# Altium project Perfect_Pour_HAT.PrjPcb
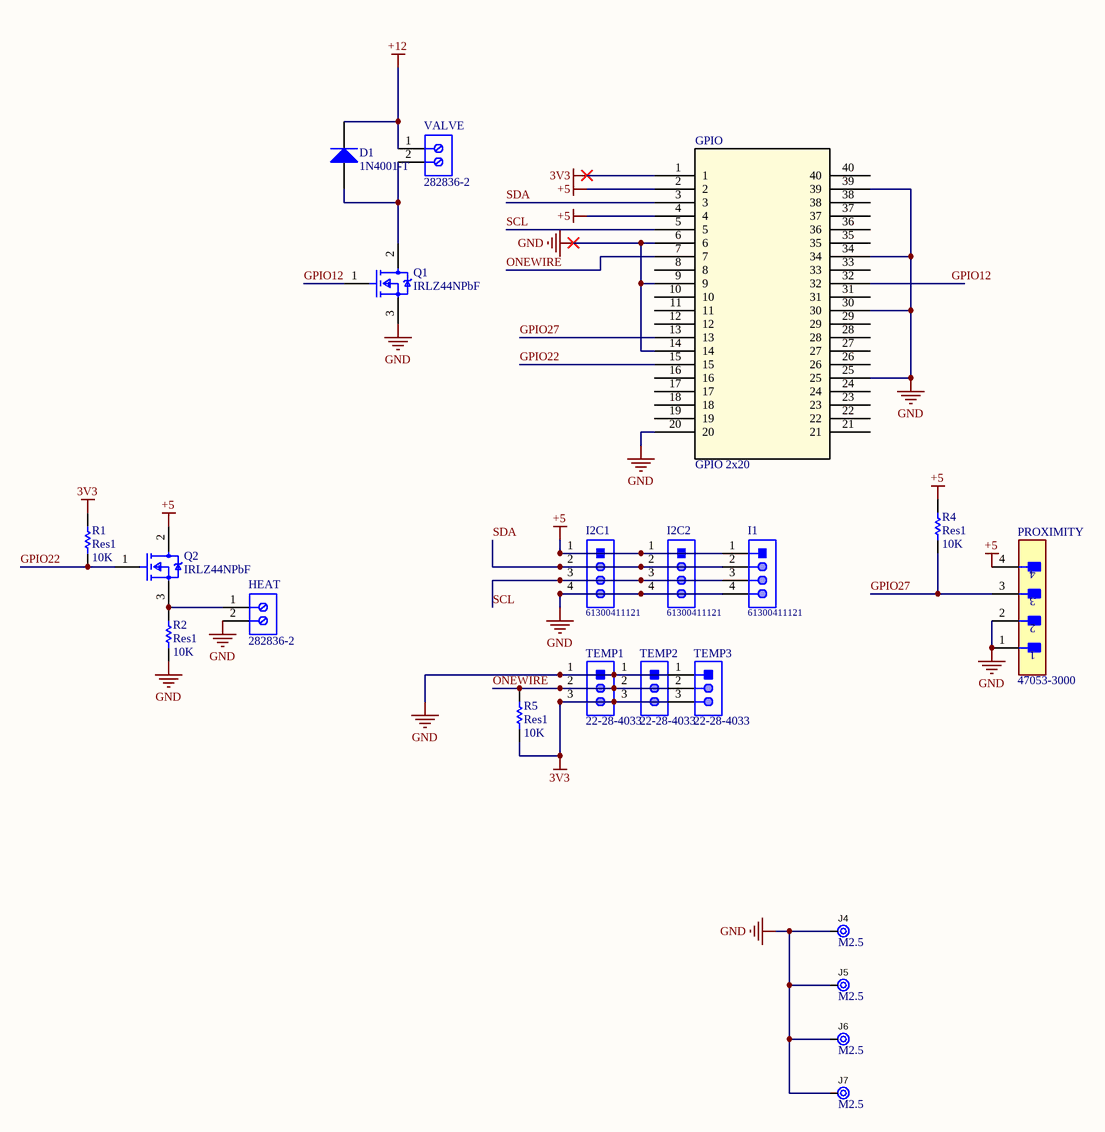
[diagram p0: ppschem.SchDoc]
1 sheet, 21 parts. Net scope: global (net labels, ports and power ports of the same name join across sheets).
Board file: pphat.PcbDoc

## Sheet ppschem.SchDoc: =DocumentName
size A3; Organization: CLIENT NAME HERE; Revision: 01; SheetNumber: 1; SheetTotal: 1; SPICEModelCacheSXWZTIYJ: <root> / <DocumentId>SXWZTIYJ</DocumentId> / </root>

### Parts
D1  1N4001-T  [DIOD-DO-41-P-2_V]
GPIO  GPIO 2x20  [GPIO2x20]
HEAT  282836-2  [TECO-282836-2_V]
I1  61300411121  [61300411121]
I2C1  61300411121  [61300411121]
I2C2  61300411121  [61300411121]
J4  M2.5  [M2.5 Drill Hole]
J5  M2.5  [M2.5 Drill Hole]
J6  M2.5  [M2.5 Drill Hole]
J7  M2.5  [M2.5 Drill Hole]
PROXIMITY  47053-3000  [FP-47053-3000-MFG]
Q1  IRLZ44NPbF  [FP-PG-TO220-3-MFG]
Q2  IRLZ44NPbF  [FP-PG-TO220-3-MFG]
R1  Res1  value 10K  [AXIAL-0.3]
R2  Res1  value 10K  [AXIAL-0.3]
R4  Res1  value 10K  [AXIAL-0.3]
R5  Res1  value 10K  [AXIAL-0.3]
TEMP1  22-28-4033  [MOLX-22-28-4033_V]
TEMP2  22-28-4033  [MOLX-22-28-4033_V]
TEMP3  22-28-4033  [MOLX-22-28-4033_V]
VALVE  282836-2  [TECO-282836-2_V]

### Nets
3V3: GPIO.1 R1.1 R5.1 TEMP1.3 TEMP2.3 TEMP3.3
+5: GPIO.2 GPIO.4 I1.1 I2C1.1 I2C2.1 PROXIMITY.4 Q2.2(D) R4.1
+12: D1.2(K) VALVE.1
GND: GPIO.6 GPIO.9 GPIO.14 GPIO.20 GPIO.25 GPIO.30 GPIO.34 GPIO.39 HEAT.2 I1.4 I2C1.4 I2C2.4 J4.?1 J5.?1 J6.?1 J7.?1 PROXIMITY.1 PROXIMITY.2 Q1.3(S) R2.2 TEMP1.1 TEMP2.1 TEMP3.1
GPIO12: GPIO.32 Q1.1(G)
GPIO22: GPIO.15 Q2.1(G) R1.2
GPIO27: GPIO.13 PROXIMITY.3 R4.2
ONEWIRE: GPIO.7 R5.2 TEMP1.2 TEMP2.2 TEMP3.2
SCL: GPIO.5 I1.3 I2C1.3 I2C2.3
SDA: GPIO.3 I1.2 I2C1.2 I2C2.2
NetD1_1: D1.1(A) Q1.2(D) VALVE.2
NetHEAT_1: HEAT.1 Q2.3(S) R2.1

Not connected (* = marked no-connect by the designer): GPIO 8 10 11 12 16 17 18 19 21 22 23 24 26 27 28 29 31 33 35 36 37 38 40

### Notes on the sheet
- Title
- Project
- ECEN 403 Team 19
- Size:
- Date:
- A3
- Sheet
- REV:
- of
- File:

### Library data of the parts
D1 = CMP-0639-00006-2: 1.0 A Rectifier, 15 pF, 50 V, -65 to 150 degC, 2-Pin DO-41 Plastic, RoHS, Tape and Reel; Manufacturer: Diodes Inc; VF (V): 1; CT (pF): 15; Max. IR (uA): 5; VRRM (V): 50; Max. IFSM (A): 30; RoHS: TRUE; Mounting Technology: Through Hole; PartNumber: 1N4001-T; ComponentLink2Description: Datasheet; DatasheetVersion: Rev. 8-2; Operating Temperature Range (degC): -65 to 150; Packing: Tape and Reel; PackageReference: DO-41-P-2; ComponentLink1URL: http://diodes.com/; PackageDescription: 2-Pin Axial Lead, Body 4.635 x 2.36 mm, Lead Spread 25.4 mm; ComponentLink2URL: http://diodes.com/datasheets/ds28002.pdf; Max. Average Rectified Current IO (A): 1; ComponentLink1Description: Manufacturer URL
GPIO = CON_383: Conn, GPIO 2x20; Mfr_Name: Adafruit Industries; Manufacturer_Part_Number: 2223; Connections: 40; Copyright: Copyright (C) 2022 Ultra Librarian. All rights reserved.; RefDes: RefDes; Type: DEV; DFC_index: CON_383; Mounting: TH; CreationDate: 11/3/2021; Creator: W.Liao; LeadFree: True; RoHS: True
HEAT VALVE = CMP-1684-00017-1: Female Header, Pitch 5 mm, 1 x 2 Position, Height 10 mm, Tail Length 3.5 mm, Rohs, Bulk; Manufacturer: TE Connectivity; Wire Gauge: 16-30AWG; Product Training Modules: Wire-to-BoardEurostyleTerminalBlocks; Clamp Material - Plating: Brass-NickelPlated; Voltage: 300V; Mating Orientation: HorizontalwithBoard; Current: 13.5A; Pitch: 0.197"(5.00mm); Screw Thread: M3; 3D Model: 282836-2.pdf; Other Names: 5ULV-02B / A98076; Dynamic Catalog: BuchananSeries; Number of Levels: 1; Torque - Screw: 0.68Nm(6Lb-In); Featured Product: EurostyleTerminalBlockConnectors; Positions Per Level: 2; Wire Termination: Screw-RisingCageClamp; Datasheet URL: http://www.te.com.cn/commerce/DocumentDelivery/DDEController?Action=showdoc&DocId=Catalog+Section%7F1308389_EUROSTYLE_TERMINAL_BLOCKS%7F0607%7Fpdf%7FEnglish%7FENG_CS_1308389_EUROSTYLE_TERMINAL_BLOCKS_0607.pdf%7F282836-2; Color: Green; Family: TerminalBlocks-WiretoBoard; RoHS Information: 282836-2StatementofCompliance; Standard Package: 300; Contact Material - Plating: Brass-TinPlated; Manufacturer URL: http://www.te.com; Housing Material: Polyamide(PA66),Nylon6/6; Features: Interlocking(Side); Package Description: Female Header, Pitch 5 mm, 1 x 2 Position, Height 10 mm, Tail Length 3.5 mm; Mounting Type: ThroughHole; Package Reference: THD; Packaging: Bulk; Series: Buchanan; Category: Connectors,Interconnects; Screw Material - Plating: Brass-NickelPlated
I1 I2C1 I2C2 = CMP-1502-01064-1: THT Vertical Pin Header WR-PHD, Pitch 2.54 mm, Single Row, 4 pins; Manufacturer: Wurth Elektronik; Withstanding Voltage: 500VAC; Rated Current: 3A; Working Voltage: 250VAC; Pin Number: 4; Gender: Male; Contact Resistance: 20mOhm; Pitch: 2.54mm; Manufacturer URL: http://www.we-online.de; Operating Temperature: -40to105degC; Packaging: Bag; Mounting Technology: THT; Package Reference: 61300411121; Datasheet URL: https://katalog.we-online.de/em/datasheet/6130xx11121.pdf; Publisher: WurthElektronik; Part Number: 61300411121; Row Number: Single; Orientation: Vertical
J4 = Mounting Hole: Raspberry Pi Mounting Hole, M2.5; DFC_index: CON_386; Mounting: TH; CreationDate: 1/20/2022; Creator: W.Liao; LeadFree: True; RoHS: True
J5-J7 = CON_386: Raspberry Pi Mounting Hole, M2.5; DFC_index: CON_386; Mounting: TH; CreationDate: 1/20/2022; Creator: W.Liao; LeadFree: True; RoHS: True
PROXIMITY = CMP-04776-000447-1: CONN HEADER VERT 4POS 2.54MM; Glow Wire Compliant: Non-compliant; Voltage Rating: 250V; Current Rating: 4A; Number of Circuits: 4; Gender: Male; Orientation: Straight; Packaging: Bulk; Series: 47053; RoHS Compliant: Yes; Termination: Through Hole; Contact Plating: Tin; Mount: Through Hole; Number of Rows: 1; Pitch: 2.54mm; Halogen Free: Low Halogen; Number of Contacts: 4; Min Operating Temperature: 0°C; Package Quantity: 12000; Contact Material: Copper Alloy; Max Operating Temperature: 75°C; REACH SVHC: No SVHC; Number of Positions: 4
Q1 Q2 = CMP-32901-000488-1: MOSFET N-CH 55V 47A TO220AB; Turn-On Delay Time: 11ns; Gate to Source Voltage (Vgs): 16V; Element Configuration: Single; Rds On Max: 22mR; Turn-Off Delay Time: 26ns; Max Power Dissipation: 110W; Threshold Voltage: 2V; Drain to Source Resistance: 35mR; Input Capacitance: 1.7nF; Continuous Drain Current (ID): 47A; Case/Package: TO-220; Lead Free: Lead Free; Halogen Free: Halogen Free; Packaging: Rail/Tube; Length: 0.414inch; Min Operating Temperature: -55°C; REACH SVHC: No SVHC; Number of Pins: 3; Width: 0.185inch; Drain to Source Voltage (Vdss): 55V; Power Dissipation: 110W; RoHS Compliant: Yes; Max Operating Temperature: 175°C; Height: 0.6inch; Max Dual Supply Voltage: 55V; Drain to Source Breakdown Voltage: 55V; Mount: Through Hole
R1 R2 R4 R5 = Res1: Resistor; Published: 8-Jun-2000; LatestRevisionDate: 17-Jul-2002; LatestRevisionNote: Re-released for DXP Platform.; PackageReference: AXIAL-0.3; Publisher: Altium Limited; PackageDescription: Axial Device, Thru-Hole; 2 Leads; 0.3 in Pin Spacing
TEMP1-TEMP3 = CMP-1676-00001-5: Male Header, Pitch 2.54 mm, 1 x 3 Position, Height 8.38 mm, Tail Length 3.18 mm, RoHS, Bulk; Manufacturer: Molex; Rows: 1; Voltage Rating: 250 V; Current Rating: 4 A; Min Operating Temperature: 0 degC; Lead Pitch: 0.1 inch; Packaging: Bulk; Contact Finish: Gold; RoHSCompliant: true; Contact Material: Brass; PackageReference: 22-28-4033; REACH SVHC: Unknown; PackageDescription: Male Header, Pitch 2.54 mm, 1 x 3 Position, Height 8.38 mm, Tail Length 3.18 mm; ComponentLink2URL: http://www.molex.com/pdm_docs/sd/022284033_sd.pdf; Height: 8.38 mm; Mounting Technology: Through Hole; ComponentLink1Description: Manufacturer URL; Length: 7.62 mm; Mount: Through Hole; DatasheetVersion: Rev. G, 01/2012; Max Operating Temperature: 75 degC; ComponentLink2Description: Datasheet; Colour: Black; Pins: 3; Contact Plating: Gold; Package Quantity: 1; ComponentLink1URL: http://www.molex.com/